# Altium schematic sheet ESP07_SHIELD.SchDoc
size A4
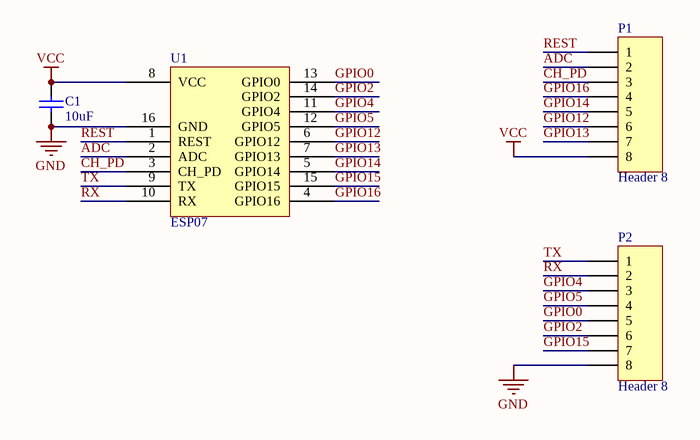
[diagram p0: ESP07_SHIELD.SchDoc]

## Parts
C1  value 10uF  [6-0805_M]  (hidden comment: Cap)
P1  Header 8  [HDR1X8]
P2  Header 8  [HDR1X8]
U1  ESP07  [ESP07]

## Nets
GND: C1.1 P2.8 U1.16(GND)
VCC: C1.2 P1.8 U1.8(VCC)
ADC: P1.2 U1.2(ADC)
CH_PD: P1.3 U1.3(CH_PD)
GPIO0: P2.5 U1.13(GPIO0)
GPIO2: P2.6 U1.14(GPIO2)
GPIO4: P2.3 U1.11(GPIO4)
GPIO5: P2.4 U1.12(GPIO5)
GPIO12: P1.6 U1.6(GPIO12)
GPIO13: P1.7 U1.7(GPIO13)
GPIO14: P1.5 U1.5(GPIO14)
GPIO15: P2.7 U1.15(GPIO15)
GPIO16: P1.4 U1.4(GPIO16)
REST: P1.1 U1.1(REST)
RX: P2.2 U1.10(RX)
TX: P2.1 U1.9(TX)

## Library data of the parts
C1 = Cap: Capacitor; Published: 8-Jun-2000; LatestRevisionDate: 17-Jul-2002; LatestRevisionNote: Re-released for DXP Platform.; PackageReference: RAD-0.3; Publisher: Altium Limited; PackageDescription: Radial Cap, Thru-Hole; 2 Leads; 0.3 in Pin Spacing
P1 P2 = Header 8: Header, 8-Pin; LatestRevisionDate: 17-Jul-2002; LatestRevisionNote: Re-released for DXP Platform.; Publisher: Altium Limited
U1 = ESP07: ESP8266